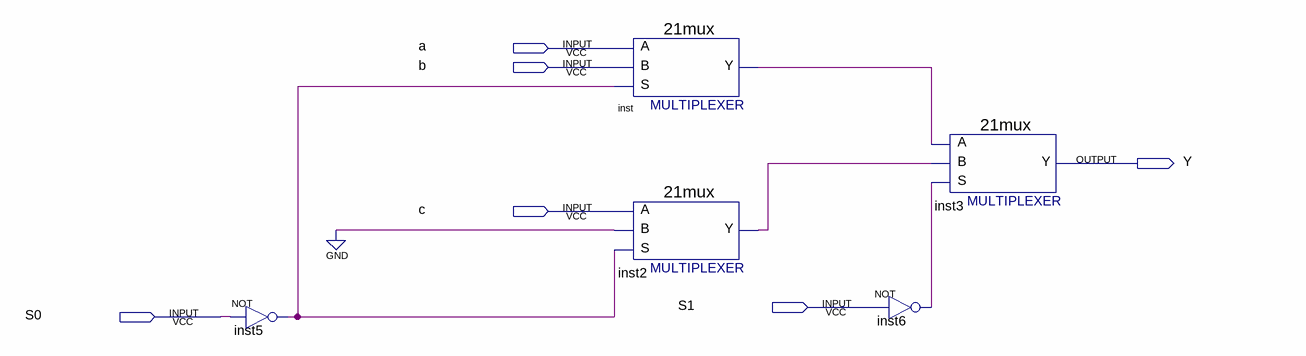
[diagram p0: schematic sheet]
// Quartus schematic 31mux.bdf as structural Verilog: 5 symbols, 6 pins
module \31mux  (
  input  a,
  input  b,
  input  c,
  input  S1,
  input  S0,
  output Y
);

  wire inst2_y, inst5_out, inst6_out, inst_y;

  not inst5 (inst5_out, S0);
  \21mux  inst (.S(inst5_out), .B(b), .A(a), .Y(inst_y));
  \21mux  inst2 (.S(inst5_out), .B(1'b0), .A(c), .Y(inst2_y));
  not inst6 (inst6_out, S1);
  \21mux  inst3 (.S(inst6_out), .B(inst2_y), .A(inst_y), .Y(Y));
endmodule
